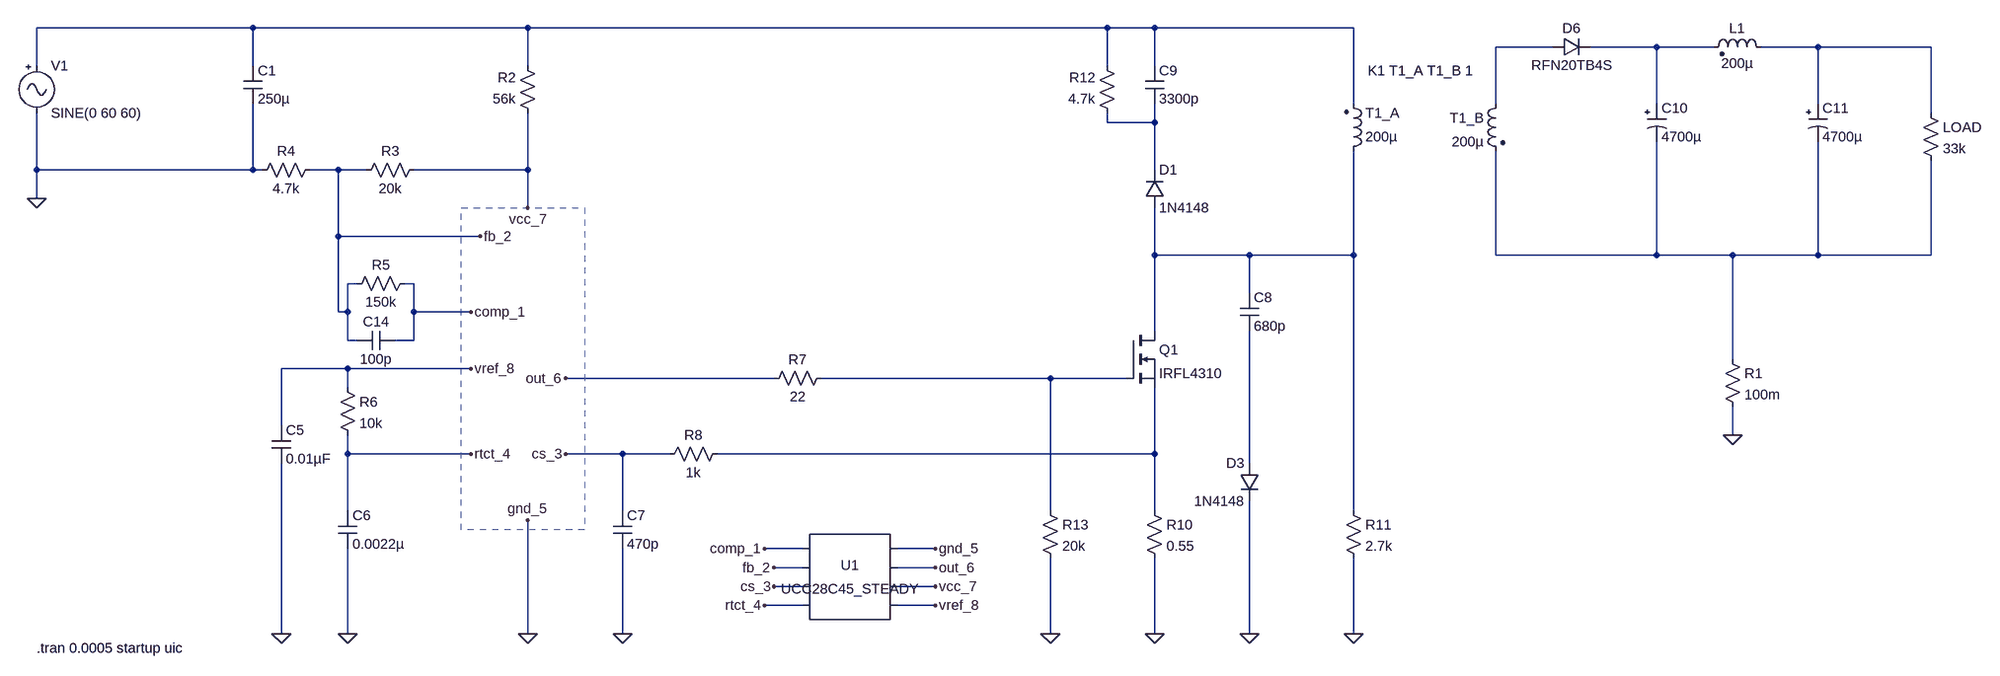
[diagram p0: schematic flyback_2.asc]
flyback_2.asc, the LTspice schematic file:
Version 4
SHEET 1 2808 956
WIRE -528 -304 -928 -304
WIRE -64 -304 -528 -304
WIRE 1216 -304 -64 -304
WIRE 1296 -304 1216 -304
WIRE 1632 -304 1296 -304
WIRE 1968 -272 1872 -272
WIRE 2144 -272 2032 -272
WIRE 2240 -272 2144 -272
WIRE 2416 -272 2320 -272
WIRE 2720 -272 2416 -272
WIRE -928 -240 -928 -304
WIRE -528 -240 -528 -304
WIRE -64 -240 -64 -304
WIRE 1216 -240 1216 -304
WIRE 1296 -240 1296 -304
WIRE 1632 -176 1632 -304
WIRE 1872 -176 1872 -272
WIRE 2144 -176 2144 -272
WIRE 2416 -176 2416 -272
WIRE 2720 -160 2720 -272
WIRE 1216 -144 1216 -160
WIRE 1296 -144 1296 -176
WIRE 1296 -144 1216 -144
WIRE -928 -64 -928 -160
WIRE -528 -64 -528 -176
WIRE -528 -64 -928 -64
WIRE -512 -64 -528 -64
WIRE -384 -64 -432 -64
WIRE -336 -64 -384 -64
WIRE -64 -64 -64 -160
WIRE -64 -64 -256 -64
WIRE 1296 -64 1296 -144
WIRE -928 -16 -928 -64
WIRE -64 0 -64 -64
WIRE -384 48 -384 -64
WIRE -144 48 -384 48
WIRE 1296 80 1296 0
WIRE 1456 80 1296 80
WIRE 1632 80 1632 -96
WIRE 1632 80 1456 80
WIRE 1872 80 1872 -96
WIRE 2144 80 2144 -112
WIRE 2144 80 1872 80
WIRE 2272 80 2144 80
WIRE 2416 80 2416 -112
WIRE 2416 80 2272 80
WIRE 2720 80 2720 -80
WIRE 2720 80 2416 80
WIRE -352 128 -368 128
WIRE -256 128 -272 128
WIRE 1456 144 1456 80
WIRE -384 176 -384 48
WIRE -368 176 -368 128
WIRE -368 176 -384 176
WIRE -256 176 -256 128
WIRE -160 176 -256 176
WIRE 1296 208 1296 80
WIRE -368 224 -368 176
WIRE -352 224 -368 224
WIRE -256 224 -256 176
WIRE -256 224 -288 224
WIRE 2272 256 2272 80
WIRE -368 272 -480 272
WIRE -160 272 -368 272
WIRE 352 288 0 288
WIRE 1120 288 432 288
WIRE 1248 288 1120 288
WIRE -368 304 -368 272
WIRE -480 368 -480 272
WIRE 2272 384 2272 336
WIRE -368 416 -368 384
WIRE -160 416 -368 416
WIRE 96 416 0 416
WIRE 176 416 96 416
WIRE 1296 416 1296 304
WIRE 1296 416 256 416
WIRE 1456 432 1456 208
WIRE -368 512 -368 416
WIRE 96 512 96 416
WIRE 1120 512 1120 288
WIRE 1296 512 1296 416
WIRE 1632 512 1632 80
WIRE 400 576 336 576
WIRE 624 576 560 576
WIRE 400 608 352 608
WIRE 624 608 560 608
WIRE 400 640 352 640
WIRE 624 640 560 640
WIRE 400 672 336 672
WIRE 624 672 560 672
WIRE -480 720 -480 432
WIRE -368 720 -368 576
WIRE -64 720 -64 528
WIRE 96 720 96 576
WIRE 1120 720 1120 592
WIRE 1296 720 1296 592
WIRE 1456 720 1456 496
WIRE 1632 720 1632 592
FLAG 336 576 comp_1
FLAG 352 608 fb_2
FLAG 352 640 cs_3
FLAG 336 672 rtct_4
FLAG 624 672 vref_8
FLAG 624 608 out_6
FLAG 624 640 vcc_7
FLAG 624 576 gnd_5
FLAG -160 176 comp_1
FLAG -144 48 fb_2
FLAG 0 416 cs_3
FLAG -160 416 rtct_4
FLAG -160 272 vref_8
FLAG 0 288 out_6
FLAG -64 0 vcc_7
FLAG -64 528 gnd_5
FLAG -64 720 0
FLAG 96 720 0
FLAG -368 720 0
FLAG -480 720 0
FLAG 1296 720 0
FLAG 1120 720 0
FLAG 1456 720 0
FLAG 1632 720 0
FLAG 2272 384 0
FLAG -928 -16 0
SYMBOL AutoGenerated\\UCC28C45_STEADY 480 624 R0
SYMATTR InstName U1
SYMBOL cap -544 -240 R0
SYMATTR InstName C1
SYMATTR Value 250µ
SYMATTR SpiceLine V=250
SYMBOL cap 1280 -240 R0
SYMATTR InstName C9
SYMATTR Value 3300p
SYMATTR SpiceLine V=600
SYMBOL res -48 -144 R180
WINDOW 0 36 76 Left 2
WINDOW 3 36 40 Left 2
SYMATTR InstName R2
SYMATTR Value 56k
SYMBOL res 1232 -144 R180
WINDOW 0 36 76 Left 2
WINDOW 3 36 40 Left 2
SYMATTR InstName R12
SYMATTR Value 4.7k
SYMATTR SpiceLine pwr=2
SYMBOL res -240 -80 R90
WINDOW 0 0 56 VBottom 2
WINDOW 3 32 56 VTop 2
SYMATTR InstName R3
SYMATTR Value 20k
SYMBOL res -416 -80 R90
WINDOW 0 0 56 VBottom 2
WINDOW 3 32 56 VTop 2
SYMATTR InstName R4
SYMATTR Value 4.7k
SYMBOL res -256 112 R90
WINDOW 0 0 56 VBottom 2
WINDOW 3 32 56 VTop 2
SYMATTR InstName R5
SYMATTR Value 150k
SYMBOL cap -288 208 R90
WINDOW 0 0 32 VBottom 2
WINDOW 3 32 32 VTop 2
SYMATTR InstName C14
SYMATTR Value 100p
SYMBOL cap -384 512 R0
SYMATTR InstName C6
SYMATTR Value 0.0022µ
SYMBOL res -384 288 R0
SYMATTR InstName R6
SYMATTR Value 10k
SYMBOL cap -496 368 R0
SYMATTR InstName C5
SYMATTR Value 0.01µF
SYMBOL res 448 272 R90
WINDOW 0 0 56 VBottom 2
WINDOW 3 32 56 VTop 2
SYMATTR InstName R7
SYMATTR Value 22
SYMBOL nmos 1248 208 R0
SYMATTR InstName Q1
SYMATTR Value IRFL4310
SYMBOL res 272 400 R90
WINDOW 0 0 56 VBottom 2
WINDOW 3 32 56 VTop 2
SYMATTR InstName R8
SYMATTR Value 1k
SYMBOL cap 80 512 R0
SYMATTR InstName C7
SYMATTR Value 470p
SYMBOL ind2 1616 -80 M180
WINDOW 0 36 80 Left 2
WINDOW 3 36 40 Left 2
SYMATTR InstName T1_A
SYMATTR Value 200µ
SYMBOL res 1280 496 R0
SYMATTR InstName R10
SYMATTR Value 0.55
SYMATTR SpiceLine pwr=1
SYMBOL res 1104 496 R0
SYMATTR InstName R13
SYMATTR Value 20k
SYMBOL cap 1440 144 R0
SYMATTR InstName C8
SYMATTR Value 680p
SYMBOL res 1616 496 R0
SYMATTR InstName R11
SYMATTR Value 2.7k
SYMATTR SpiceLine pwr=2
SYMBOL ind2 1888 -192 M0
SYMATTR InstName T1_B
SYMATTR Value 200µ
SYMBOL diode 1968 -256 R270
WINDOW 0 32 32 VTop 2
WINDOW 3 0 32 VBottom 2
SYMATTR InstName D6
SYMATTR Value RFN20TB4S
SYMBOL polcap 2128 -176 R0
SYMATTR InstName C10
SYMATTR Value 4700µ
SYMATTR SpiceLine V=10
SYMBOL polcap 2400 -176 R0
SYMATTR InstName C11
SYMATTR Value 4700µ
SYMBOL ind2 2336 -256 M270
WINDOW 0 32 56 VTop 2
WINDOW 3 4 56 VBottom 2
SYMATTR InstName L1
SYMATTR Value 200µ
SYMBOL Misc\\signal -928 -256 R0
WINDOW 123 0 0 Left 0
WINDOW 39 0 0 Left 0
SYMATTR InstName V1
SYMATTR Value SINE(0 60 60)
SYMBOL res 2704 -176 R0
SYMATTR InstName LOAD
SYMATTR Value 33k
SYMBOL res 2256 240 R0
SYMATTR InstName R1
SYMATTR Value 100m
SYMBOL diode 1472 432 M0
SYMATTR InstName D3
SYMATTR Value 1N4148
SYMBOL diode 1280 0 M180
WINDOW 0 24 64 Left 2
WINDOW 3 24 0 Left 2
SYMATTR InstName D1
SYMATTR Value 1N4148
TEXT 1656 -232 Left 2 !K1 T1_A T1_B 1
TEXT -928 744 Left 2 !.tran 0.0005 startup uic
RECTANGLE Normal 32 544 -176 0 2

The netlist it stands for:
* flyback_2.asc
* U1: UCC28C45_STEADY (symbol AutoGenerated\UCC28C45_STEADY not available, pins judged from their places): pin1=comp_1 pin2=fb_2 pin3=cs_3 pin4=rtct_4 pin5=0 pin6=out_6 pin7=vcc_7 pin8=vref_8
C1 N001 0 250µ V=250
C9 N001 N005 3300p V=600
R2 vcc_7 N001 56k
R12 N005 N001 4.7k pwr=2
R3 vcc_7 fb_2 20k
R4 fb_2 0 4.7k
R5 comp_1 fb_2 150k
C14 comp_1 fb_2 100p
C6 rtct_4 0 0.0022µ
R6 vref_8 rtct_4 10k
C5 vref_8 0 0.01µF
R7 N008 out_6 22
M§Q1 N006 N008 N009 N009 IRFL4310
R8 N009 cs_3 1k
C7 cs_3 0 470p
L§T1_A N006 N001 200µ
R10 N009 0 0.55 pwr=1
R13 N008 0 20k
C8 N006 N010 680p
R11 N006 0 2.7k pwr=2
L§T1_B N002 N007 200µ
D6 N002 N003 RFN20TB4S
C10 N003 N007 4700µ V=10
C11 N004 N007 4700µ
L1 N004 N003 200µ
V1 N001 0 SINE(0 60 60)
R§LOAD N004 N007 33k
R1 N007 0 100m
D3 N010 0 1N4148
D1 N006 N005 1N4148
.model D D
.lib standard.dio
.model NMOS NMOS
.model PMOS PMOS
.lib standard.mos
K1 T1_A T1_B 1
.tran 0.0005 startup uic
.backanno
.end